# EAGLE design cp2104 (EAGLE 7.6.0)
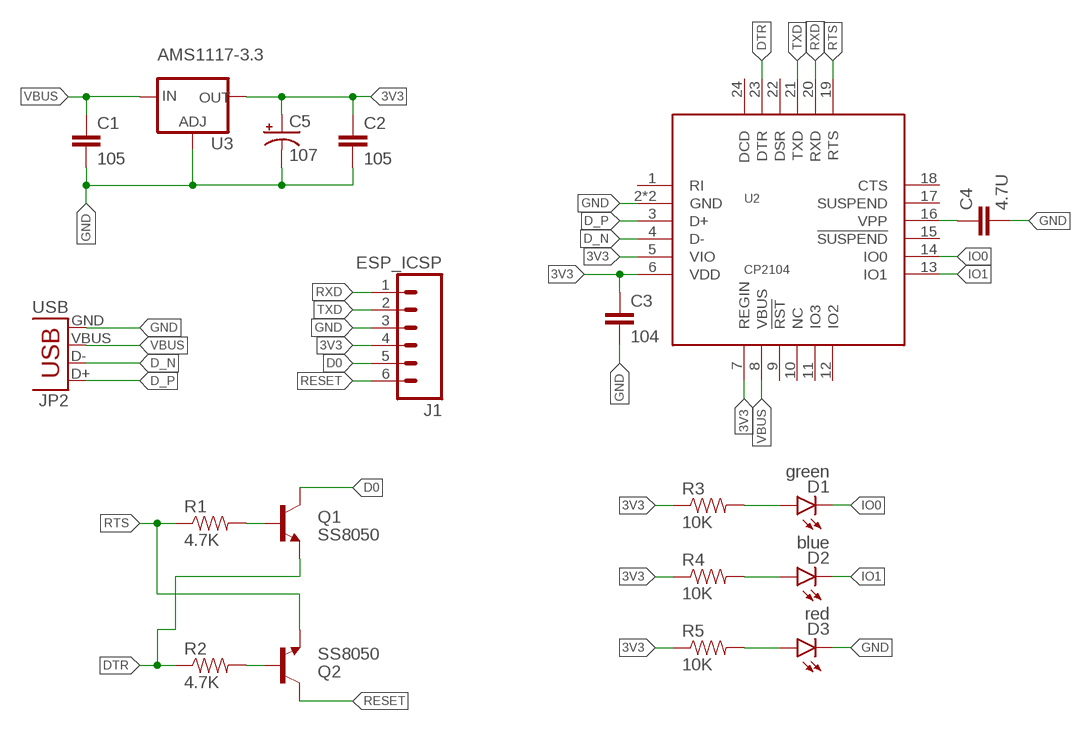
[diagram p0: schematic, sheet 1]

## Parts
C1  105  CAP0603-CAP  [0603-CAP]
C2  105  CAP0603-CAP  [0603-CAP]
C3  104  CAP0603-CAP  [0603-CAP]
C4  4.7U  CAP0603-CAP  [0603-CAP]
C5  107  CAP_POL3528  [EIA3528]
D1  green  LED-SEEED-0603  [LED-0603-SEEED]
D2  blue  LED-SEEED-0603  [LED-0603-SEEED]
D3  red  LED-SEEED-0603  [LED-0603-SEEED]
J1  ESP_ICSP  M06NO_SILK_FEMALE_PTH  [1X06_NO_SILK]
JP2  USB  [MICROUSB-U-F-M5DD-Y-1]
Q1  SS8050  TRANSISTOR_NPN-JLC-SMT  [SOT23-3-JLC]
Q2  SS8050  TRANSISTOR_NPN-JLC-SMT  [SOT23-3-JLC]
R1  4.7K  RESISTOR0603-RES  [0603-RES]
R2  4.7K  RESISTOR0603-RES  [0603-RES]
R3  10K  RESISTOR0603-RES  [0603-RES]
R4  10K  RESISTOR0603-RES  [0603-RES]
R5  10K  RESISTOR0603-RES  [0603-RES]
U2  CP2104  [QFN24]
U3  AMS1117-3.3  AMS1117SOT223  [SOT223]

## Nets
3V3: C2.1 C3.1 C5.A(+) J1.4 R3.1 R4.1 R5.1 U2.5(VIO) U2.6(VDD) U2.7(REGIN) U3.2(OUT) U3.4(OUT)
D0: J1.5 Q1.3(C)
D_N: JP2.D- U2.4(D-)
D_P: JP2.D+ U2.3(D+)
DTR: Q1.2(E) R2.1 U2.23(DTR)
GND: C1.2 C2.2 C3.2 C4.2 C5.C(-) D3.-(C) J1.3 JP2.GND U2.2(GND) U2.25(GND) U3.1(ADJ)
IO0: D1.-(C) U2.14(IO0)
IO1: D2.-(C) U2.13(IO1)
N$1: C4.1 U2.16(VPP)
N$2: D3.+(A) R5.2
N$4: D1.+(A) R3.2
N$5: D2.+(A) R4.2
N$6: Q1.1(B) R1.2
N$8: Q2.1(B) R2.2
RESET: J1.6 Q2.3(C)
RTS: Q2.2(E) R1.1 U2.19(RTS)
RXD: J1.1 U2.20(RXD)
TXD: J1.2 U2.21(TXD)
VBUS: C1.1 JP2.VBUS U2.8(VBUS) U3.3(IN)
Unconnected: U2.1(RI) U2.9(!RST) U2.10(NC) U2.11(IO3) U2.12(IO2) U2.15(!SUSPEND) U2.17(SUSPEND) U2.18(CTS) U2.22(DSR) U2.24(DCD)

## Library data of the parts
C1-C4 = z_jlc_smt:CAP: Capacitor Standard 0603 ceramic capacitor, and 0.1" leaded capacitor.
C5 = z_jlc_smt:CAP_POL: Capacitor Polarized These are standard SMD and PTH capacitors. Normally 10uF, 47uF, and 100uF in electrolytic and tantalum varieties. Always verify the external diameter of the through hole cap, it varies with capacity, voltage, and manufacturer. The EIA devices should be standard.
D1-D3 = z_jlc_smt:LED: LEDs Standard schematic elements and footprints for 5mm, 3mm, 1206, and 0603 sized LEDs. 5mm - Spark Fun Electronics SKU : COM-00529 (and others)
J1 = SparkFun-Connectors:M06: Header 6 Standard 6-pin 0.1" header. Use with straight break away headers (SKU : PRT-00116), right angle break away headers (PRT-00553), swiss pins (PRT-00743), machine pins (PRT-00117), and female headers (PRT-00115). Molex polarized connector foot print use with SKU : PRT-08094 with associated crimp pins and housings. NOTES ON THE VARIANTS LOCK and LOCK_LONGPADS... This footprint was designed to help hold the alignment of a through-hole component (i.e. 6-pin header) while soldering it into place. You may notice that each hole has been shifted either up or down by 0.005 of an inch from it's more standard position (which is a perfectly straight line). This slight alteration caused the pins (the squares in the middle) to touch the edges of the holes. Because they are alternating, it causes a "brace" to hold the component in place. 0.005 has proven to be the perfect amount of "off-center" position when using our standard breakaway headers. Although looks a little odd when you look at the bare footprint, once you have a header in there, the alteration is very hard to notice. Also,if you push a header all the way into place, it is covered up entirely on the bottom side. This idea of altering the position of holes to aid alignment will be further integrated into the Sparkfun Library for other footprints. It can help hold any component with 3 or more connection pins.; PROD_ID: CONN-08437
JP2 = xmgu2008:USB: USB Connectors USB-B-PTH is fully proven SKU : PRT-00139/CONN-08278 USB-miniB is fully proven SKU : PRT-00587 USB-A-PCB is untested. USB-A-H is throughly reviewed, but untested. Spark Fun Electronics SKU : PRT-00437 USB-B-SMT is throughly reviewed, but untested. Needs silkscreen touching up. USB-A-S has not been used/tested USB-MB-H has not been used/tested USB-MICROB has been used. CONN-09505
Q1 Q2 = z_jlc_smt:TRANSISTOR_NPN: Generic NPN BJT MMBT2222A - TRANS-08049 (SOT-23, 1A 40V) MPSA42 - TRANS-09116 (SOT-23, 500mA 300V) MMBT5088LT1G - TRANS-11160 (SOT-23, 50 mA 30V) BC547 - COM-08928 <http://www.sparkfun.com/products/8928> (TO-92 45V 100mA) (1.Collector 2.Base 3.Emitter) 2N3904 - COM-00521 <http://www.sparkfun.com/products/521> (TO-92 40V 200mA) (1.Emitter 2.Base 3.Collector) P2N2222A - COM-12852 <http://www.sparkfun.com/products/12852> (TO-92 40V 600mA) (1.Collector 2.Base 3.Emitter)
R1-R5 = z_jlc_smt:RESISTOR: Resistor Basic schematic elements and footprints for 0603, 1206, and PTH resistors.
U2 = xmgu2008:CP2104
U3 = z_jlc_smt:AMS1117: Voltage Regulator AMS1117; PROD_ID: VREG-08170

## Board
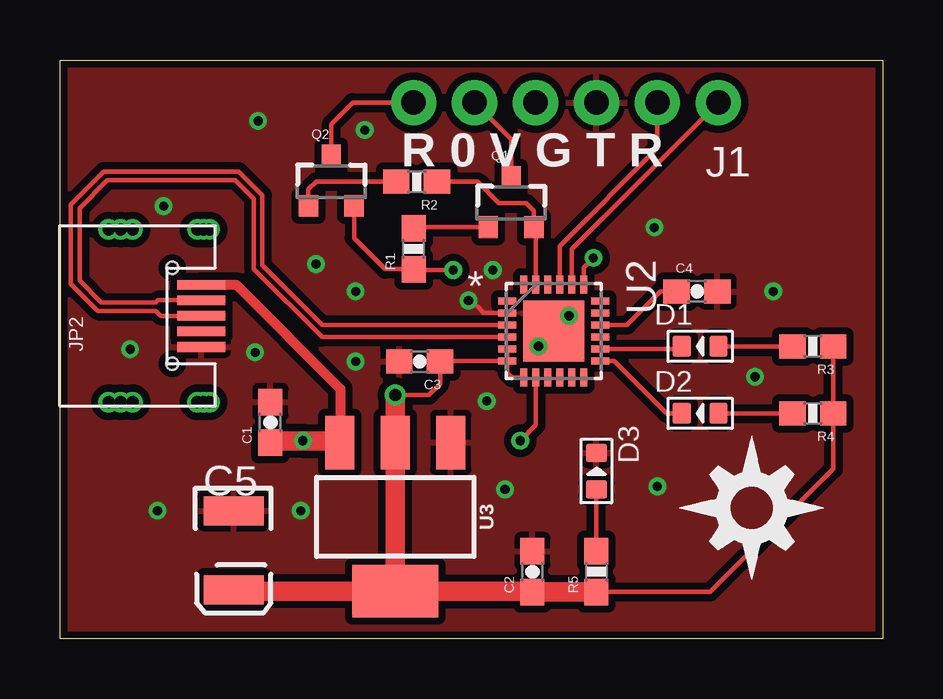
[diagram p1: board, top side]
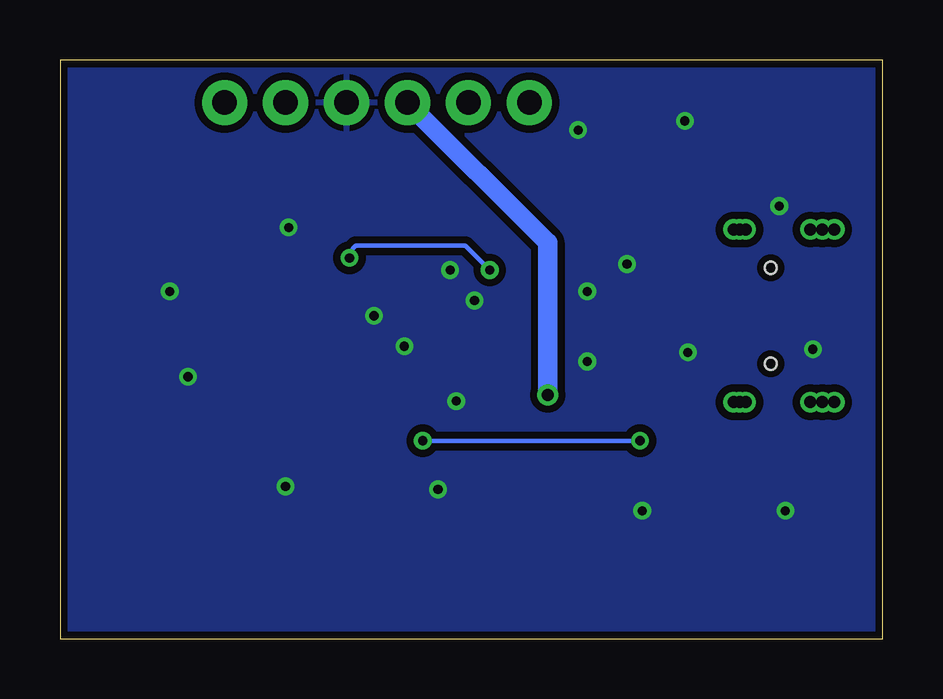
[diagram p2: board, bottom side, seen from below]

Size 34.29 x 24.13 mm. Coordinates in mm from the lower left corner, seen from the top.
Outline: 0,0 0,24.13 34.29,24.13 34.29,0 0,0
Copper layers (1*16): Top 0.035mm / dielectric 1.5mm / Bottom 0.035mm
Design rules "SparkFun-2-layer-TIGHT": minimum track width 7mil, minimum drill 15mil, track to track 7mil, track to pad 7mil, pad to pad 7mil, via to via 7mil, smd to smd 7mil, copper to edge 7mil, drill to drill 7mil, minimum pad ring 7mil, minimum via ring 7mil, stop-mask expansion 4mil, vias tented up to drill 20mil, thermal gap 10mil

### Footprints (pad centres in the part's own frame; a part is rotated, then mirrored left to right if it is on the bottom)
0603-CAP = smd 1.1 x 1: 1 -0.85,0; 2 0.85,0
EIA3528 = smd 1.2 x 2.5: A 1.65,0; C -1.65,0
LED-0603-SEEED = smd 0.762 x 0.889: + 0.762,0; - -0.762,0
1X06_NO_SILK = drill 1.016 pad 1.88: 1 0,0; 2 2.54,0; 3 5.08,0; 4 7.62,0; 5 10.16,0; 6 12.7,0
MICROUSB-U-F-M5DD-Y-1 = drill 0.5: 6_1 3.6,0.25; 6_2 3.6,0.5; 6_3 3.6,0.75; 7_1 3.6,3.45; 7_2 3.6,3.95; 7_3 3.6,4.45; 8_1 -3.6,4.45; 8_2 -3.6,3.95; 8_3 -3.6,3.45; 9_1 -3.6,0.75; 9_2 -3.6,0.5; 9_3 -3.6,0.25 | smd 0.4 x 2: D+ 0,0.6; D- 0.65,0.6; GND -1.3,0.6; ID -0.65,0.6; VBUS 1.3,0.6 | hole 0.5: -2,1.8; 2,1.8
SOT23-3-JLC = smd 0.9 x 0.8: 1 1,-0.95; 2 1,0.95; 3 -1.1,0
0603-RES = smd 1.1 x 1: 1 -0.85,0; 2 0.85,0
QFN24 = smd 0.3 x 0.75: 1 -1.25,-1.943; 2 -0.75,-1.943; 3 -0.25,-1.943; 4 0.25,-1.943; 5 0.75,-1.943; 6 1.25,-1.943; 13 1.25,1.943; 14 0.75,1.943; 15 0.25,1.943; 16 -0.25,1.943; 17 -0.75,1.943; 18 -1.25,1.943 | smd 0.75 x 0.3: 7 1.943,-1.25; 8 1.943,-0.75; 9 1.943,-0.25; 10 1.943,0.25; 11 1.943,0.75; 12 1.943,1.25; 19 -1.943,1.25; 20 -1.943,0.75; 21 -1.943,0.25; 22 -1.943,-0.25; 23 -1.943,-0.75; 24 -1.943,-1.25 | smd 2.54 x 2.54: 25 0,0
SOT223 = smd 2.235 x 1.219: 1 3.099,-2.311; 2 3.099,0; 3 3.099,2.311 | smd 2.2 x 3.6: 4 -3.099,0

### Placement (x,y rotation side)
C1  8.76,9.02 90 top
C2  19.68,2.79 90 top
C3  14.99,11.56 180 top
C4  26.54,14.48 0 top
C5  7.24,3.68 270 top
D1  26.67,12.19 0 top
D2  26.67,9.4 0 top
D3  22.35,6.99 270 top
J1  27.43,22.35 180 top
JP2  6.48,13.46 90 top
Q1  18.8,18.16 270 top
Q2  11.3,19.05 270 top
R1  14.73,16.26 90 top
R2  14.86,19.05 180 top
R3  31.37,12.19 180 top
R4  31.37,9.4 180 top
R5  22.35,2.79 90 top
U2  20.57,12.83 270 top
U3  13.97,5.08 90 top
U$1  [DIYNOVA_LOGO]  25.78,2.41 0 top

### Tracks (layer width: path | path; a pad name or v marks a point on that pad's centre or on a via)
3V3  (via drill 0.51)
  Top 0.178: R5.1 27.09,1.94 32.22,7.07 R4.1 R3.1 | U2.6 15.86,11.58 C3.1 15.84,10.63 15.37,10.16 v13.97,10.16 | U3.2 13.97,9.65 | U2.6 18.63,11.09 18.83,10.88 U2.7 | U2.6 U2.5
  Top 0.813: U3.4 U3.2 v13.97,10.16 | U3.4 7.29,1.98 C5.A | U3.4 19.65,1.98 C2.1 R5.1
  Bottom 0.813: J1.4 13.97,16.51 v13.97,10.16
D0
  Top 0.178: 17.32,22.31 J1.5 18.8,20.83 Q1.3
D_N
  Top 0.178: U2.4 10.92,12.58 8.08,15.42 8.08,18.34 7.29,19.13 1.98,19.13 0.81,17.96 0.81,14.93 1.73,14.02 3.99,14.02 4.08,14.11 JP2.D-
D_P
  Top 0.178: U2.3 10.92,13.08 8.43,15.57 8.43,18.49 7.44,19.48 1.83,19.48 0.46,18.11 0.46,14.79 1.58,13.66 3.99,13.66 4.19,13.46 JP2.D+
DTR
  Top 0.178: U2.23 19.82,17.08 Q1.2 19.75,17.85 19.43,18.16 18.29,18.16 17.4,19.05 R2.1
GND  (via drill 0.38)
  Top 0.178: U2.2 17.66,13.58 17.4,13.84 | U2.25 v21.21,13.46
  other vias: 12.32,11.56 8.13,11.94 2.92,12.06 4.32,18.03 10.67,15.62 24.89,6.35 28.96,10.92 29.72,14.48 17.78,9.91 18.54,6.22 4.06,5.33 10.03,5.33 12.32,14.48 19.94,12.19 17.02,14.1 18.03,15.37 24.77,17.14 12.7,21.21 8.26,21.59
  pour Bottom (isolate 0.305): 0,0 0,24.13 34.29,24.13 34.29,0
  pour Top (isolate 0.305): 0,0 0,24.13 34.29,24.13 34.29,0
IO0
  Top 0.178: U2.14 25.79,12.08 D1.-
IO1
  Top 0.178: U2.13 23.09,11.58 25.27,9.4 D2.-
N$1
  Top 0.178: U2.16 23.62,13.08 25.02,14.48 C4.1
N$2
  Top 0.178: R5.2 D3.+
N$4
  Top 0.178: D1.+ R3.2
N$5
  Top 0.178: D2.+ R4.2
N$6
  Top 0.178: Q1.1 14.79,17.16 R1.2
N$8
  Top 0.178: R2.2 10.67,19.05 10.35,18.73 Q2.1
RESET
  Top 0.178: Q2.3 11.3,21.46 12.19,22.35 J1.6
RTS  (via drill 0.38)
  Top 0.178: U2.19 21.82,15.47 v22.23,15.88 | v16.38,15.37 14.77,15.37 R1.1 13.55,15.41 12.25,16.7 Q2.2
  Bottom 0.178: v22.23,15.88 22.23,16.13 21.97,16.38 17.4,16.38 v16.38,15.37
RXD
  Top 0.178: U2.20 21.32,16.24 J1.1
TXD
  Top 0.178: U2.21 20.82,16.38 24.89,20.45 J1.2
VBUS  (via drill 0.38)
  Top 0.178: U2.8 19.82,8.9 v19.18,8.26
  Top 0.406: JP2.VBUS 7.34,14.76 11.68,10.41 11.68,8.2 U3.3
  Top 0.813: 11.65,8.17 U3.3 11.58,8.26 v10.12,8.26 8.85,8.26 C1.1
  Bottom 0.178: v19.18,8.26 v10.12,8.26

### Text on the board
tPlace: R 0 V G T R